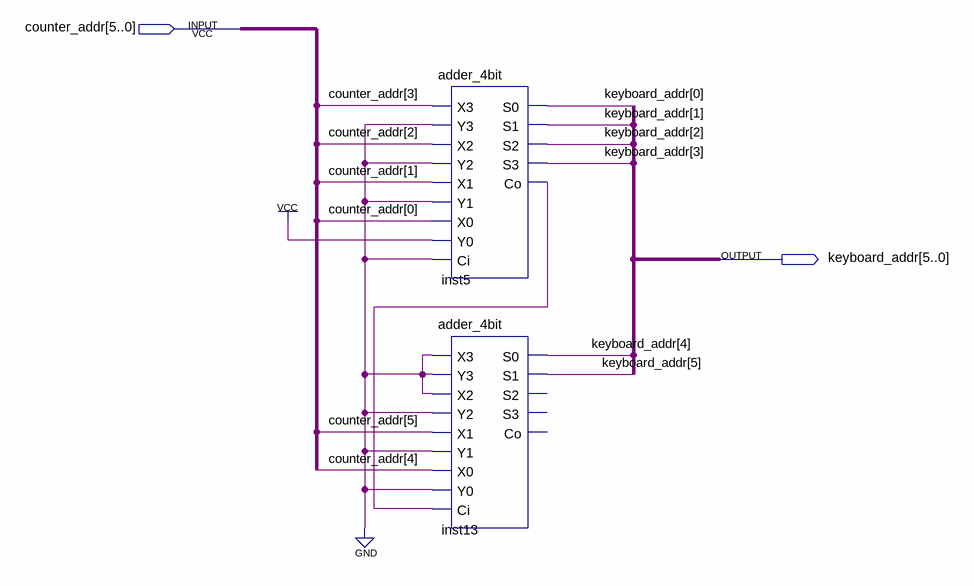
[diagram p0: schematic sheet]
// Quartus schematic addr_plus_one.bdf as structural Verilog: 2 symbols, 2 pins
module addr_plus_one (
  input  [5:0] counter_addr,
  output [5:0] keyboard_addr
);

  wire inst5_co;

  adder_4bit inst5 (
    .X3(counter_addr[3]), .Y3(1'b0), .X2(counter_addr[2]), .Y2(1'b0), .X1(counter_addr[1]), .Y1(1'b0),
    .X0(counter_addr[0]), .Y0(1'b1), .Ci(1'b0), .S0(keyboard_addr[0]), .S1(keyboard_addr[1]),
    .S2(keyboard_addr[2]), .S3(keyboard_addr[3]), .Co(inst5_co));
  adder_4bit inst13 (
    .X3(1'b0), .Y3(1'b0), .X2(1'b0), .Y2(1'b0), .X1(counter_addr[5]), .Y1(1'b0), .X0(counter_addr[4]),
    .Y0(1'b0), .Ci(inst5_co), .S0(keyboard_addr[4]), .S1(keyboard_addr[5]));  // open: S2, S3, Co
endmodule
